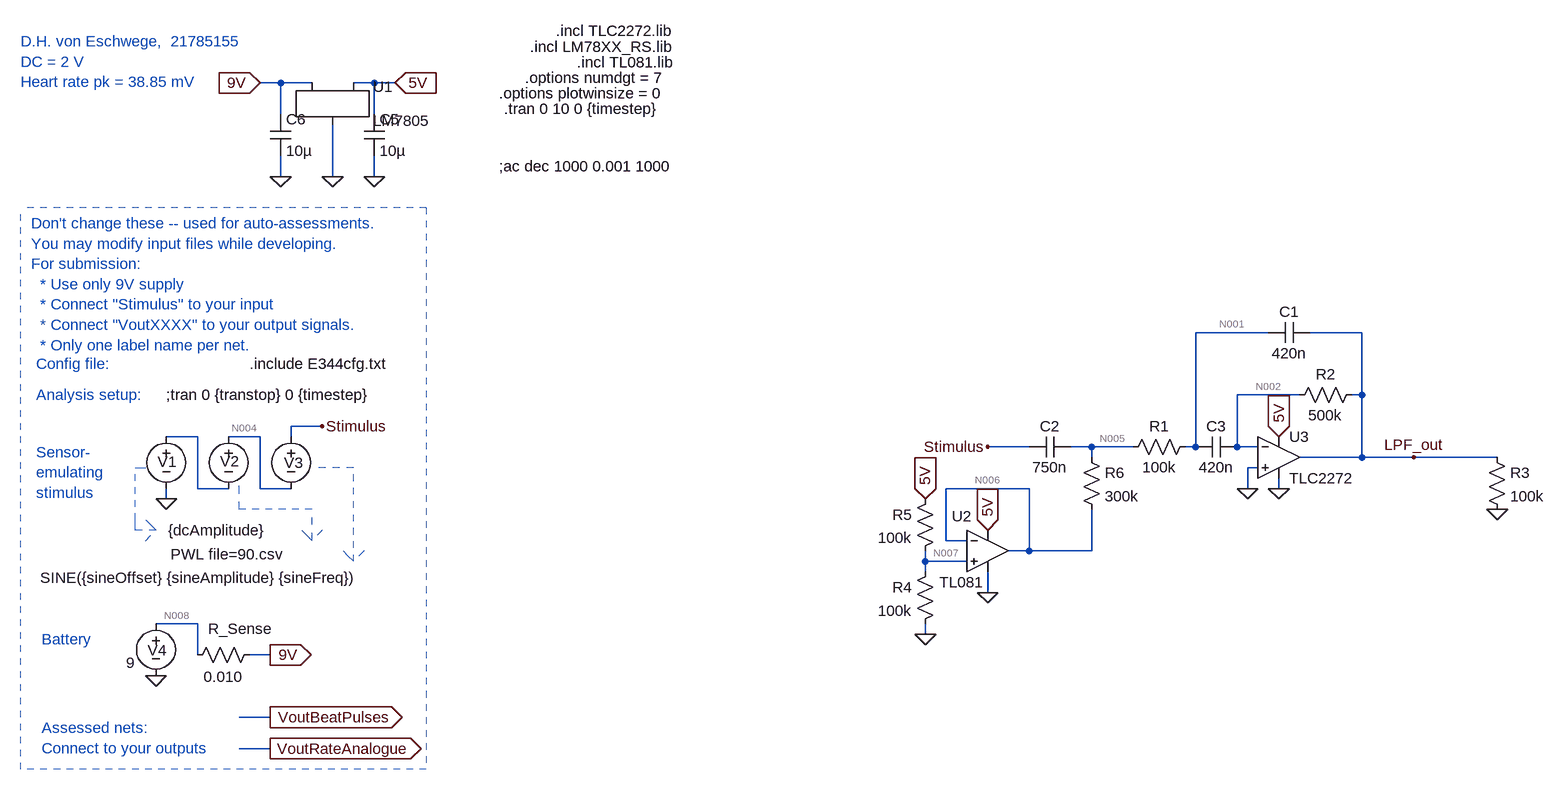
[diagram p0: schematic X_2ndOrderBPF_Schmitt - Simplified.asc]
X_2ndOrderBPF_Schmitt - Simplified.asc, the LTspice schematic file:
Version 4
SHEET 1 1824 680
WIRE -1904 -1600 -1936 -1600
WIRE -1856 -1600 -1904 -1600
WIRE -1760 -1600 -1792 -1600
WIRE -1728 -1600 -1760 -1600
WIRE -1904 -1552 -1904 -1600
WIRE -1760 -1552 -1760 -1600
WIRE -1904 -1456 -1904 -1488
WIRE -1824 -1456 -1824 -1536
WIRE -1760 -1456 -1760 -1488
WIRE -384 -1216 -496 -1216
WIRE -240 -1216 -320 -1216
WIRE -336 -1120 -432 -1120
WIRE -240 -1120 -240 -1216
WIRE -240 -1120 -256 -1120
WIRE -1840 -1072 -1888 -1072
WIRE -2032 -1056 -2080 -1056
WIRE -1936 -1056 -1984 -1056
WIRE -1888 -1056 -1888 -1072
WIRE -752 -1040 -816 -1040
WIRE -656 -1040 -688 -1040
WIRE -592 -1040 -656 -1040
WIRE -496 -1040 -496 -1216
WIRE -496 -1040 -512 -1040
WIRE -432 -1040 -432 -1120
WIRE -400 -1040 -432 -1040
WIRE -656 -1024 -656 -1040
WIRE -240 -1024 -240 -1120
WIRE -240 -1024 -336 -1024
WIRE -160 -1024 -240 -1024
WIRE -32 -1024 -160 -1024
WIRE -400 -1008 -416 -1008
WIRE -2032 -976 -2032 -1056
WIRE -1984 -976 -2032 -976
WIRE -1936 -976 -1936 -1056
WIRE -1888 -976 -1936 -976
WIRE -752 -976 -880 -976
WIRE -416 -976 -416 -1008
WIRE -368 -976 -368 -992
WIRE -2080 -960 -2080 -976
WIRE -880 -896 -880 -976
WIRE -848 -896 -880 -896
WIRE -752 -880 -752 -976
WIRE -752 -880 -784 -880
WIRE -656 -880 -656 -944
WIRE -656 -880 -752 -880
WIRE -912 -864 -912 -880
WIRE -848 -864 -912 -864
WIRE -912 -848 -912 -864
WIRE -816 -816 -816 -848
WIRE -2032 -768 -2096 -768
WIRE -912 -752 -912 -768
WIRE -2032 -720 -2032 -768
WIRE -1920 -720 -1952 -720
WIRE -1920 -624 -1968 -624
WIRE -1920 -576 -1968 -576
FLAG -2080 -960 0
FLAG -1840 -1072 Stimulus
FLAG -1920 -720 9V
IOPIN -1920 -720 Out
FLAG -2096 -688 0
FLAG -1920 -624 VoutBeatPulses
IOPIN -1920 -624 Out
FLAG -1920 -576 VoutRateAnalogue
IOPIN -1920 -576 Out
FLAG -1824 -1456 0
FLAG -1936 -1600 9V
IOPIN -1936 -1600 In
FLAG -1904 -1456 0
FLAG -1760 -1456 0
FLAG -1728 -1600 5V
IOPIN -1728 -1600 In
FLAG -368 -1056 5V
IOPIN -368 -1056 In
FLAG -160 -1024 LPF_out
FLAG -368 -976 0
FLAG -416 -976 0
FLAG -32 -944 0
FLAG -912 -752 0
FLAG -912 -960 5V
IOPIN -912 -960 In
FLAG -816 -816 0
FLAG -816 -912 5V
IOPIN -816 -912 In
FLAG -816 -1040 Stimulus
SYMBOL voltage -1984 -1072 R0
WINDOW 123 0 0 Left 0
WINDOW 39 0 0 Left 0
WINDOW 3 -89 197 Left 2
WINDOW 0 -13 54 Left 2
SYMATTR Value PWL file=90.csv
SYMATTR InstName V2
SYMBOL voltage -1888 -1072 R0
WINDOW 123 24 44 Left 2
WINDOW 39 0 0 Left 0
WINDOW 3 -386 233 Left 2
WINDOW 0 -11 56 Left 2
SYMATTR Value SINE({sineOffset} {sineAmplitude} {sineFreq})
SYMATTR InstName V3
SYMBOL voltage -2080 -1072 R0
WINDOW 123 0 0 Left 0
WINDOW 39 0 0 Left 0
WINDOW 3 3 160 Left 2
WINDOW 0 -13 55 Left 2
SYMATTR Value {dcAmplitude}
SYMATTR InstName V1
SYMBOL voltage -2096 -784 R0
WINDOW 123 24 44 Left 2
WINDOW 39 0 0 Left 0
WINDOW 3 -46 76 Left 2
WINDOW 0 -13 57 Left 2
SYMATTR Value 9
SYMATTR InstName V4
SYMBOL res -1936 -736 R90
WINDOW 0 -9 30 VBottom 2
WINDOW 3 34 56 VTop 2
SYMATTR InstName R_Sense
SYMATTR Value 0.010
SYMBOL LM7805 -1824 -1584 R0
SYMATTR InstName U1
SYMBOL cap -432 -1056 R90
WINDOW 0 0 32 VBottom 2
WINDOW 3 32 32 VTop 2
SYMATTR InstName C3
SYMATTR Value 420n
SYMBOL Opamps\\opamp2 -368 -1088 R0
SYMATTR InstName U3
SYMATTR Value TLC2272
SYMBOL res -496 -1056 R90
WINDOW 0 0 56 VBottom 2
WINDOW 3 32 56 VTop 2
SYMATTR InstName R1
SYMATTR Value 100k
SYMBOL res -240 -1136 R90
WINDOW 0 0 56 VBottom 2
WINDOW 3 32 56 VTop 2
SYMATTR InstName R2
SYMATTR Value 500k
SYMBOL cap -1776 -1552 R0
SYMATTR InstName C5
SYMATTR Value 10µ
SYMBOL cap -1920 -1552 R0
SYMATTR InstName C6
SYMATTR Value 10µ
SYMBOL cap -320 -1232 R90
WINDOW 0 0 32 VBottom 2
WINDOW 3 32 32 VTop 2
SYMATTR InstName C1
SYMATTR Value 420n
SYMBOL res -48 -1040 R0
SYMATTR InstName R3
SYMATTR Value 100k
SYMBOL cap -688 -1056 R90
WINDOW 0 0 32 VBottom 2
WINDOW 3 32 32 VTop 2
SYMATTR InstName C2
SYMATTR Value 750n
SYMBOL res -896 -864 M0
SYMATTR InstName R4
SYMATTR Value 100k
SYMBOL res -896 -976 M0
SYMATTR InstName R5
SYMATTR Value 100k
SYMBOL Opamps\\opamp2 -816 -944 R0
WINDOW 0 -55 11 Left 2
WINDOW 3 -74 112 Left 2
SYMATTR InstName U2
SYMATTR Value TL081
SYMBOL res -672 -1040 R0
SYMATTR InstName R6
SYMATTR Value 300k
TEXT -2080 -1120 Left 2 !;tran 0 {transtop} 0 {timestep}
TEXT -1952 -1168 Left 2 !.include E344cfg.txt
TEXT -2288 -1384 Left 2 ;Don't change these -- used for auto-assessments.\nYou may modify input files while developing.\nFor submission: \n  * Use only 9V supply \n  * Connect "Stimulus" to your input\n  * Connect "VoutXXXX" to your output signals.\n  * Only one label name per net.
TEXT -2280 -1168 Left 2 ;Config file:
TEXT -2280 -1120 Left 2 ;Analysis setup:
TEXT -2272 -744 Left 2 ;Battery
TEXT -2280 -1032 Left 2 ;Sensor-\nemulating \nstimulus
TEXT -2272 -608 Left 2 ;Assessed nets:\nConnect to your outputs
TEXT -2304 -1664 Left 2 ;D.H. von Eschwege,  21785155\nDC = 2 V\nHeart rate pk = 38.85 mV
TEXT -1480 -1680 Left 2 !.incl TLC2272.lib
TEXT -1520 -1656 Left 2 !.incl LM78XX_RS.lib
TEXT -1448 -1632 Left 2 !.incl TL081.lib
TEXT -1528 -1608 Left 2 !.options numdgt = 7
TEXT -1568 -1584 Left 2 !.options plotwinsize = 0
TEXT -1568 -1472 Left 2 !;ac dec 1000 0.001 1000
TEXT -1560 -1560 Left 2 !.tran 0 10 0 {timestep}
LINE Normal -1792 -1008 -1856 -1008 2
LINE Normal -1792 -864 -1792 -1008 2
LINE Normal -1808 -880 -1792 -864 2
LINE Normal -1792 -864 -1808 -880 2
LINE Normal -1776 -880 -1792 -864 2
LINE Normal -2128 -1008 -2112 -1008 2
LINE Normal -2128 -928 -2128 -1008 2
LINE Normal -2128 -912 -2128 -928 2
LINE Normal -2096 -912 -2128 -912 2
LINE Normal -2112 -928 -2096 -912 2
LINE Normal -2096 -912 -2112 -928 2
LINE Normal -2112 -896 -2096 -912 2
LINE Normal -1968 -944 -1968 -992 2
LINE Normal -1856 -944 -1968 -944 2
LINE Normal -1856 -896 -1856 -944 2
LINE Normal -1872 -912 -1856 -896 2
LINE Normal -1856 -896 -1872 -912 2
LINE Normal -1840 -912 -1856 -896 2
LINE Normal -2304 -544 -2304 -1408 1
LINE Normal -1680 -1408 -1680 -544 1
LINE Normal -1680 -544 -2304 -544 1
LINE Normal -1680 -1408 -2304 -1408 1

The netlist it stands for:
* X_2ndOrderBPF_Schmitt - Simplified.asc
V2 N004 N003 PWL file=90.csv
V3 Stimulus N004 SINE({sineOffset} {sineAmplitude} {sineFreq})
V1 N003 0 {dcAmplitude}
V4 N008 0 9
R_Sense 9V N008 0.010
XU1 9V 0 5V LM7805
C3 N002 N001 420n
XU3 0 N002 5V 0 LPF_out TLC2272  ; pins In+ In- V+ V- OUT
R1 N001 N005 100k
R2 LPF_out N002 500k
C5 5V 0 10µ
C6 9V 0 10µ
C1 LPF_out N001 420n
R3 LPF_out 0 100k
C2 N005 Stimulus 750n
R4 N007 0 100k
R5 5V N007 100k
XU2 N007 N006 5V 0 N006 TL081  ; pins In+ In- V+ V- OUT
R6 N005 N006 300k
;tran 0 {transtop} 0 {timestep}
.include E344cfg.txt
* Don't change these -- used for auto-assessments.
* You may modify input files while developing.
* For submission:
*   * Use only 9V supply
*   * Connect "Stimulus" to your input
*   * Connect "VoutXXXX" to your output signals.
*   * Only one label name per net.
* Config file:
* Analysis setup:
* Battery
* Sensor-
* emulating
* stimulus
* Assessed nets:
* Connect to your outputs
* D.H. von Eschwege,  21785155
* DC = 2 V
* Heart rate pk = 38.85 mV
.incl TLC2272.lib
.incl LM78XX_RS.lib
.incl TL081.lib
.options numdgt = 7
.options plotwinsize = 0
;ac dec 1000 0.001 1000
.tran 0 10 0 {timestep}
.backanno
.end

* Results of the author's LTspice run, read from the files saved beside the schematic
* Operating Point, zero values left out:
*   V(n004) = 2.005 V
*   V(stimulus) = 2.005 V
*   V(n008) = 9 V
*   V(9v) = 9 V
*   V(5v) = 5.003 V
*   V(n002) = 9.16 mV
*   V(n001) = 2.501 V
*   V(lpf_out) = 9.154 mV
*   V(n005) = 2.501 V
*   V(n007) = 2.501 V
*   V(n006) = 2.501 V
*   I(R5) = 25.01 µA
*   I(R4) = 25.01 µA
*   I(R3) = 91.54 nA
*   I(R2) = -11.96 pA
*   I(R_sense) = -9.975 mA
*   I(V4) = -9.975 mA
*   Ix(u1:1) = 9.975 mA
*   Ix(u1:2) = -5.02 mA
*   Ix(u1:3) = -4.955 mA
*   Ix(u3:IN+) = -11.51 pA
*   Ix(u3:IN-) = -11.96 pA
*   Ix(u3:VCC) = 2.4 mA
*   Ix(u3:VEE) = -2.4 mA
*   Ix(u3:OUT) = -91.53 nA
*   Ix(u2:1) = 32.55 pA
*   Ix(u2:2) = 32.55 pA
*   Ix(u2:3) = 2.53 mA
*   Ix(u2:4) = -2.53 mA
*   Ix(u2:5) = -32.55 pA